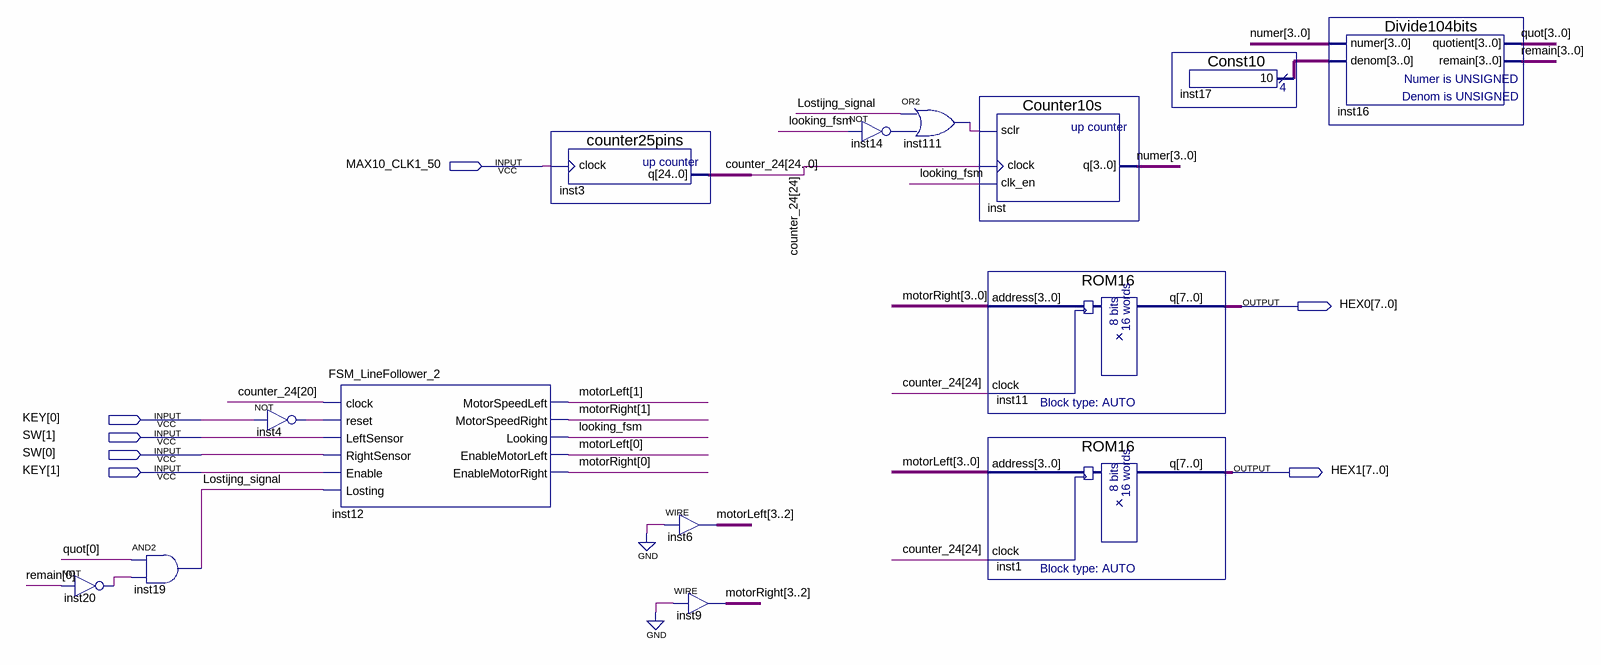
[diagram p0: schematic sheet]
// Quartus schematic Projeto1.bdf as structural Verilog: 14 symbols, 7 pins
module Projeto1 (
  input  MAX10_CLK1_50,
  input  [1:0] KEY,
  input  [1:0] SW,
  output [7:0] HEX0,
  output [7:0] HEX1
);

  wire inst4_out, inst14_out, inst20_out, inst111_out, looking_fsm, Lostijng_signal;
  wire [3:0] inst17_result, motorLeft, motorRight, numer, quot, remain;
  wire [24:0] counter_24;

  not inst20 (inst20_out, remain[0]);
  and inst19 (Lostijng_signal, quot[0], inst20_out);
  not inst4 (inst4_out, KEY[0]);
  FSM_LineFollower_2 inst12 (
    .clock(counter_24[20]), .reset(inst4_out), .LeftSensor(SW[1]), .RightSensor(SW[0]), .Enable(KEY[1]),
    .Losting(Lostijng_signal), .MotorSpeedLeft(motorLeft[1]), .MotorSpeedRight(motorRight[1]),
    .Looking(looking_fsm), .EnableMotorLeft(motorLeft[0]), .EnableMotorRight(motorRight[0]));
  counter25pins inst3 (.clock(MAX10_CLK1_50), .q(counter_24));
  assign motorLeft[3:2] = 2'b00;  // WIRE inst6
  assign motorRight[3:2] = 2'b00;  // WIRE inst9
  or inst111 (inst111_out, Lostijng_signal, inst14_out);
  not inst14 (inst14_out, looking_fsm);
  Counter10s inst (.sclr(inst111_out), .clock(counter_24[24]), .clk_en(looking_fsm), .q(numer));
  ROM16 inst11 (.address(motorRight), .clock(counter_24[24]), .q(HEX0));
  ROM16 inst1 (.address(motorLeft), .clock(counter_24[24]), .q(HEX1));
  Const10 inst17 (.result(inst17_result));
  Divide104bits inst16 (.numer(numer), .denom(inst17_result), .quotient(quot), .remain(remain));
endmodule
